# Altium schematic sheet power.SchDoc
size A4
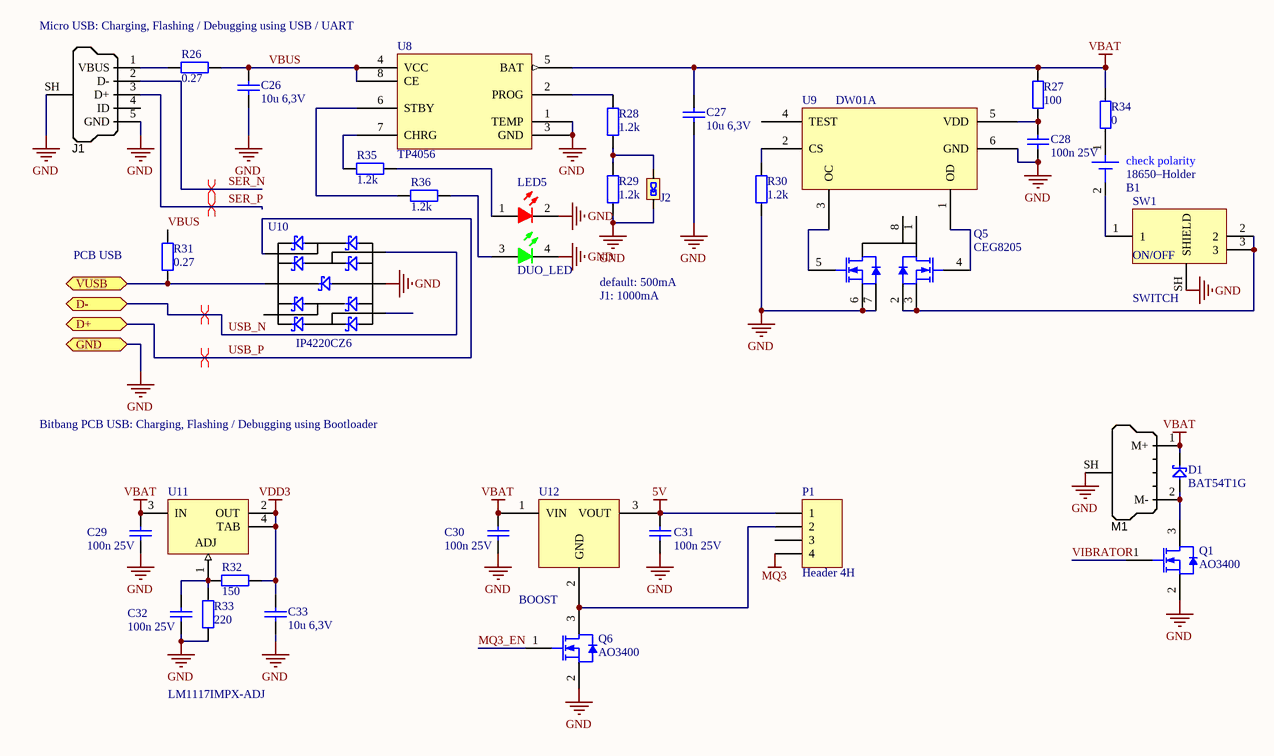
[diagram p0: power.SchDoc]

## Parts
B1  18650–Holder  [18650–Holder]
C26  10u 6,3V  [C-0603-H]
C27  10u 6,3V  [C-0603-H]
C28  100n 25V  [C-0603-M]
C29  100n 25V  [C-0603-M]
C30  100n 25V  [C-0603-M]
C31  100n 25V  [C-0603-M]
C32  100n 25V  [C-0603-M]
C33  10u 6,3V  [C-0603-H]
D1  BAT54T1G  [SOD123]
J1  USB Micro Type B (recommended if hand soldering)  [USB_Micro-Molex]  (value not drawn)
J2  jumper  [JUMPER 1-1]  (value not drawn)
LED5  DUO_LED  [LEDDUO]
M1  VIBRATOR  [VIBRATOR_SMD]  (value not drawn)
P1  Header 4H  [HDR1X4H]
Q1  AO3400  [AO-SOT23-3_V]
Q5  CEG8205  [TSSOP8]
Q6  AO3400  [AO-SOT23-3_V]
R26  0.27  [R-1206-M]
R27  100  [R-0603-M]
R28  1.2k  [R-0603-M]
R29  1.2k  [R-0603-M]
R30  1.2k  [R-0603-M]
R31  0.27  [R-1206-M]
R32  150  [R-0603-M]
R33  220  [R-0603-M]
R34  0  [R-0603-M]
R35  1.2k  [R-0603-M]
R36  1.2k  [R-0603-M]
SW1  SWITCH  [SWITCH]
U8  TP4056  [SOIC127P600X20_HS-9N]
U9  DW01A  [SOT23-6]
U10  IP4220CZ6  [SOT23-6]
U11  LM1117IMPX-ADJ  [MP04A_L]
U12  BOOST  [BOOST]

## Ports
D+, D-, GND, VUSB

## Nets
5V: C31.2 P1.1 U12.3(VOUT)
GND: C26.1 C27.1 C28.1 C29.1 C30.1 C31.1 C32.1 C33.1 J1.5(GND) J1.SH(Shell) J2.2 LED5.2(K) LED5.4(K) M1.SH(Shell) Q1.2(S) Q5.6(S2) Q5.7(S2) Q6.2(S) R29.1 R30.1 R33.1 SW1.SH(SHIELD) U8.1(TEMP) U8.3(GND) U9.6(GND) U10.2(GND) ; port GND
MQ3: P1.4
VBAT: C27.2 C29.2 C30.2 D1.2(kt) M1.1(M+) R27.2 R34.2 U8.5(BAT) U11.3(IN) U12.1(VIN)
VDD3: C33.2 R32.1 U11.2(OUT) U11.4(TAB)
MQ3_EN: Q6.1(G)
SER_N: J1.2(D-)
SER_P: J1.3(D+)
USB_N: U10.3(bla4) ; port D-
USB_P: U10.4(bla2) ; port D+
VBUS: C26.2 R26.2 R31.2 U8.4(VCC) U8.8(CE)
VIBRATOR: Q1.1(G)
VUSB: R31.1 U10.5(VBUS) ; port VUSB
NetB1_1: B1.1 R34.1
NetB1_2: B1.2 SW1.1
NetC28_2: C28.2 R27.1 U9.5(VDD)
NetC32_2: C32.2 R32.2 R33.2 U11.1(ADJ)
NetD1_1: D1.1(an) M1.2(M-) Q1.3(D)
NetJ1_1: J1.1(VBUS) R26.1
NetJ2_1: J2.1 R28.1 R29.2
NetLED5_1: LED5.1(A) R35.1
NetLED5_3: LED5.3(A) R36.1
NetP1_2: P1.2 Q6.3(D) U12.2(GND)
NetQ5_2: Q5.2(S1) Q5.3(S1) SW1.2 SW1.3
NetQ5_4: Q5.4(G1) U9.1(OD)
NetQ5_5: Q5.5(G2) U9.3(OC)
NetR28_2: R28.2 U8.2(PROG)
NetR30_2: R30.2 U9.2(CS)
NetR35_2: R35.2 U8.7(CHRG)
NetR36_2: R36.2 U8.6(STBY)

Not connected (* = marked no-connect by the designer): J1 4(ID); P1 3; Q5 1(S) 8(D); U9 4(TEST); U10 1(bla3) 6(bla1)

## Layout directives
differential pair: SER_N, SER_P, USB_N, USB_P

## Notes on the sheet
- Micro USB: Charging, Flashing / Debugging using USB / UART
- (near R31) PCB USB
- default: 500mA
- J1: 1000mA
- Bitbang PCB USB: Charging, Flashing / Debugging using Bootloader
- Title
- Size:
- Date:
- A4
- Number:
- Time:
- Revision:
- Sheet
- of
- File:
- (in symbol 18650–Holder) check polarity
- (in symbol SWITCH) ON/OFF

## Library data of the parts
C26 C27 C33 = C-0603-10u-6,3V: Capacitor 10uF 6,3V; Supplier 1: Mouser; Supplier Part Number 1: 80-C0603C106M9P
C28-C32 = C-0603-100n-25V: Capacitor 100n 25V; Supplier 1: Mouser; Supplier Part Number 1: 80-C0603C104K3R
D1 = D-BAT54T1G: Supplier 1: Mouser; Supplier Part Number 1: 863-BAT54T1G
J1 = USB_Micro_MOLEX: Connector SMD-THD USB Micro Type B middle mount
J2 = jumper 1-1
M1 = VIBRATOR: rawr
P1 = Header 4H: Header, 4-Pin, Right Angle; LatestRevisionDate: 17-Jul-2002; LatestRevisionNote: Re-released for DXP Platform.; Publisher: Altium Limited
Q1 Q6 = CMP-0278-00001-1: N-channel Enhancement Mode Field-Effect Transistor; 5.8A/30V; Manufacturer: Alpha and Omega; Channel Type: N; Drain-Source Voltage Limit: 30 V; Junction Temperature: -55 to 150 degC; Gate-Source Voltage Limit: +/-12 V; PackageDescription: 3-Pin SOT23, 3.016 x 2.8 mm Body, 0.95 mm Pitch; ComponentLink2Description: Datasheet; DatasheetVersion: Rev.8, 12/2011; ComponentLink3URL: http://www.aosmd.com/res/packaging_information/SOT-23.pdf; Storage Temperature: -55 to 150 degC; ComponentLink3Description: Package Specification; PackageReference: SOT23; ComponentLink1Description: Manufacturer URL; Mounting Technology: Surface Mount; ComponentLink1URL: http://www.aosmd.com/; PartNumber: AO3400; ComponentLink2URL: http://www.aosmd.com/res/data_sheets/AO3400.pdf
Q5 = MOSFET-CEG8205: Dual mini mosfet 20V 4.5A; Supplier 1: AliExpress
R26 R31 = R-1206-0R27: Resistor 0.27; Supplier 1: Mouser; Supplier Part Number 1: 71-RCWE1206R270FKEA
R27 = R-0603-100: Resistor 100; Supplier 1: Mouser; Supplier Part Number 1: 71-CRCW0603-100-E3
R28-R30 R35 R36 = R-0603-1k2: Resistor 1.2k
R32 = R-0603-150: Resistor 150; Supplier 1: Mouser; Supplier Part Number 1: 71-CRCW0603-150K-E3
R33 = R-0603-220: Resistor 220; Supplier 1: Digi-Key; Supplier Part Number 1: 541-220HTR-ND
R34 = R-0603-0: Resistor 0; Supplier 1: Mouser; Supplier Part Number 1: 71-CRCW0603-0-E3; Resistance: 0
U8 = TP4056: 1A standalone linear charging IC; Supplier 1: AliExpress
U9 = DW01A: Single Cell LiIon LiPo Protection
U10 = IP4220CZ6: USB ESD Protection
U11 = CMP-0062-01617-3: 800mA Low-Dropout Linear Regulator, 4-pin SOT-223; Manufacturer: National Semiconductor; PackageTopMarking: XYTT*N03B; High-Reliability: Y; PowerWise: N; CompType: LDO IC; PackageVersion: revB, Apr-2003; ComponentLink1URL: http://www.national.com/; PackageReference: MP04A; ComponentLink2URL: http://www.national.com/ds/LM/LM1117.pdf; ComponentLink2Description: LM1117 Datasheet; ComponentLink4URL: http://www.national.com/packaging/folders/mp04a.html; PackageDescription: Molded SOT-223, 6.50 x 3.56 x 1.6mm Body, 4 Lead, 2.3mm Pitch; PartNumber: LM1117IMPX-ADJ; ComponentLink3URL: http://www.national.com/pf/LM/LM1117.html; RoHS: N; PinCount: 4; DatasheetVersion: Apr-2006; Code_IPC: SOT223-4; ComponentLink3Description: LM1117 Web Page; Code_JEDEC: TO-261-AA; ComponentLink1Description: Manufacturer URL; ComponentLink4Description: MP04A Package Page; RevisionNote: SCH symbol layout adjusted